# Altium schematic sheet E-12 USB PD.SchDoc: FRDM-IMX93
size 513 x 386 mm; DrawnBy: FORLINX; Organization: ORGANIZATION; Address1: ADDRESS 1; Address2: ADDRESS 2; Address3: ADDRESS 3; Address4: ADDRESS 4; Revision: -; ENG_APP_DATE: --/--/--; DSN_APP_DATE: --/--/--; CHK_APP_DATE: --/--/--; Classification: Public, Company Internal/Proprietary, Company Confidential,  Company Secret; Page Create Date: March  8, 1995; OrgName: NXP Semiconductor; FIUO: A; OrgAddr1: NO. 192 Liangjing Rd. Pudong New Area, ShangHai; Page Number: 12; PageTitle: USB PD; Page Size: C; Page Count: 23; Designer: FORLINX; RevCode: B1; Approver: NXP SE; Doc: SCH-94611 PDF: SPF-94611; DsnPath: T:\FILES\Designs\Single Board Computers\i.MX93-FRDM\Design Files\SCH-94611_B1.DSN; SchematicName: FRDM-i.MX 93 Development Board; PageName: E-12 USB PD; PageSize: C; TopSchematic: True
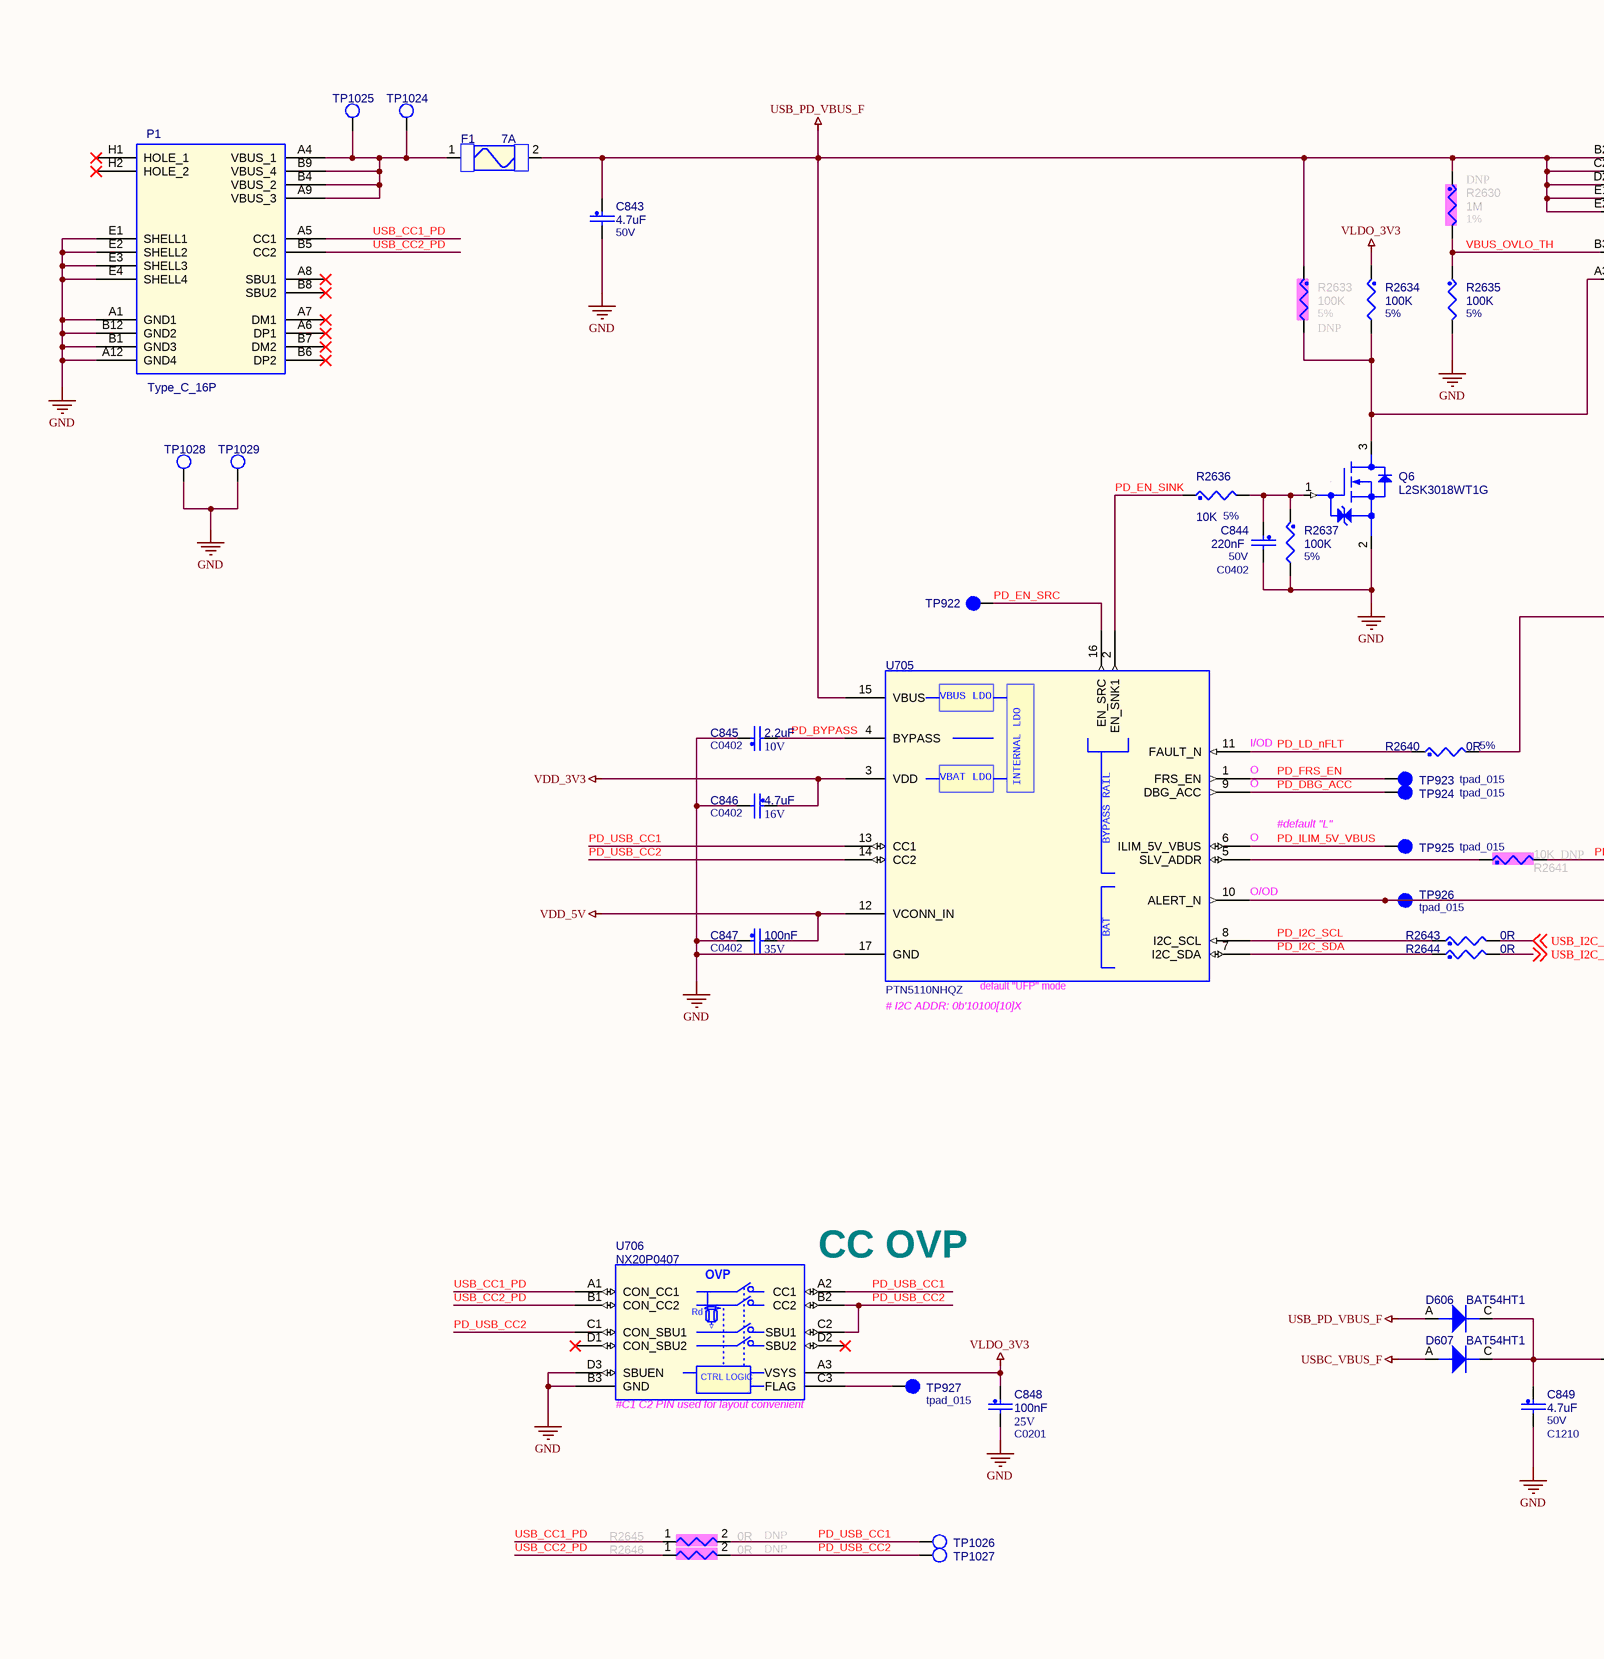
[diagram p0: E-12 USB PD.SchDoc, left]
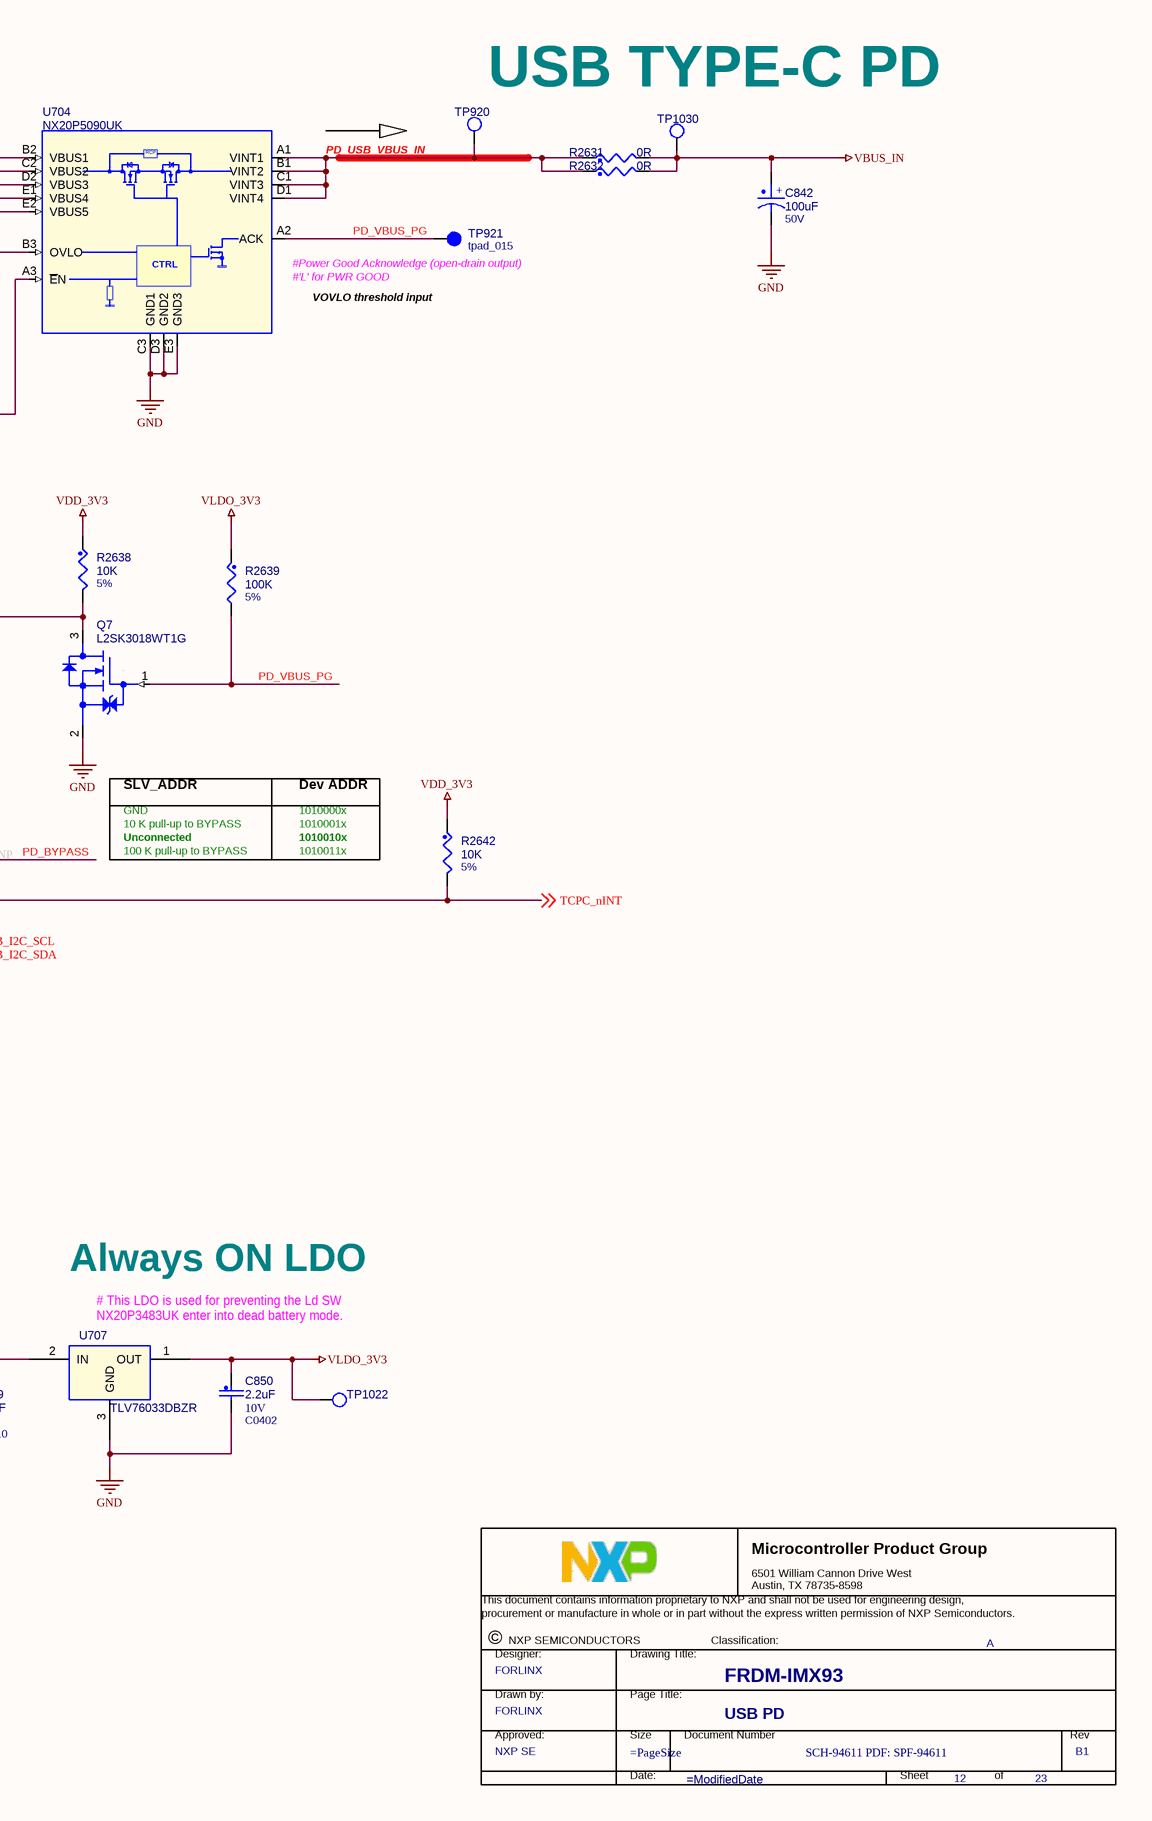
[diagram p1: E-12 USB PD.SchDoc, right]

## Parts
*  Title: FRDM-IMX93  RevCode: B1  PageTitle: USB PD  Page Number: 12  Page Count: 23  DrawnBy: FORLINX  Doc: SCH-94611 PDF: SPF-94611  Approver: NXP SE  FIUO: A  (graphical)
C842  100uF  VOLTAGE: 50V  [cce6P3x7p7]
C843  4.7uF  VOLTAGE: 50V  [C1210]
C844  220nF  VOLTAGE: 50V  [C0402]
C845  2.2uF  VOLTAGE: 10V  [C0402]
C846  4.7uF  VOLTAGE: 16V  [C0402]
C847  100nF  VOLTAGE: 35V  [C0402]
C848  100nF  VOLTAGE: 25V  [C0201]
C849  4.7uF  VOLTAGE: 50V  [C1210]
C850  2.2uF  VOLTAGE: 10V  [C0402]
D606  BAT54HT1  [SOD323]
D607  BAT54HT1  [SOD323]
F1  7A  [fuse_3p4x1p8]
P1  Type_C_16P  [TypeC_16P_S]
Q6  L2SK3018WT1G  [sc70_3]
Q7  L2SK3018WT1G  [sc70_3]
R2630  1M  ASSY_OPT: DNP  Tolerance: 1%  [R0201]
R2631  0R  [R0805]
R2632  0R  [R0805]
R2633  100K  ASSY_OPT: DNP  Tolerance: 5%  [R0201]
R2634  100K  Tolerance: 5%  [R0201]
R2635  100K  Tolerance: 5%  [R0201]
R2636  10K  Tolerance: 5%  [R0201]
R2637  100K  Tolerance: 5%  [R0201]
R2638  10K  Tolerance: 5%  [R0201]
R2639  100K  Tolerance: 5%  [R0201]
R2640  0R  Tolerance: 5%  [R0201]
R2641  10K  ASSY_OPT: DNP  [R0402]
R2642  10K  Tolerance: 5%  [R0201]
R2643  0R  [R0201]
R2644  0R  [R0201]
R2645  0R  ASSY_OPT: DNP  [R0201]
R2646  0R  ASSY_OPT: DNP  [R0201]
TP920  TPAD_020  [tpad_020]  (value not drawn)
TP921  TPAD_015  [tpad_015]
TP922  TPAD_015  [tpad_015]  (value not drawn)
TP923  TPAD_015  [tpad_015]
TP924  TPAD_015  [tpad_015]
TP925  TPAD_015  [tpad_015]
TP926  TPAD_015  [tpad_015]
TP927  TPAD_015  [tpad_015]
TP1022  TPAD_020  [tpad_020]  (value not drawn)
TP1024  TPAD_020  [tpad_020]  (value not drawn)
TP1025  TPAD_020  [tpad_020]  (value not drawn)
TP1026  TPAD_020  [tpad_020]  (value not drawn)
TP1027  TPAD_020  [tpad_020]  (value not drawn)
TP1028  TPAD_020  [tpad_020]  (value not drawn)
TP1029  TPAD_020  [tpad_020]  (value not drawn)
TP1030  TPAD_020  [tpad_020]  (value not drawn)
U704  NX20P5090UK  [wlcsp15_0p5_1p57x2p59]
U705  MFG_PN01: PTN5110NHQZ  [hx2qfn16_0p4_2p7x2p7]  (hidden comment: PTN5110)
U706  NX20P0407  [wlcsp12_0p4_1p3x1p7mm_smdp]
U707  TLV76033DBZR  [sot23_a]

## Nets
GND: C842.2 C843.2 C844.2 C845.1 C846.2 C847.1 C848.2 C849.2 C850.2 P1.A1(GND1) P1.A12(GND4) P1.B1(GND3) P1.B12(GND2) P1.E1(SHELL1) P1.E2(SHELL2) P1.E3(SHELL3) P1.E4(SHELL4) Q6.2(SOURCE) Q7.2(SOURCE) R2635.2 R2637.2 TP1028.1(TP) TP1029.1(TP) U704.C3(GND1) U704.D3(GND2) U704.E3(GND3) U705.17(GND) U706.B3(GND) U706.D3(SBUEN) U707.3(GND)
USB_PD_VBUS_F: C843.1 D606.A(ANODE) F1.2 R2630.1 R2633.1 U704.B2(VBUS1) U704.C2(VBUS2) U704.D2(VBUS3) U704.E1(VBUS4) U704.E2(VBUS5) U705.15(VBUS)
USBC_VBUS_F: D607.A(ANODE)
VBUS_IN: C842.1 R2631.2 R2632.2 TP1030.1(TP)
VDD_3V3: C846.1 R2638.1 R2642.1 U705.3(VDD)
VDD_5V: C847.2 U705.12(VCONN_IN)
VLDO_3V3: C848.1 C850.1 R2634.1 R2639.1 TP1022.1(TP) U706.A3(VSYS) U707.1(OUT)
PD_BYPASS: C845.2 R2641.2 U705.4(BYPASS)
PD_DBG_ACC: TP924.1(Pin1) U705.9(DBG_ACC)
PD_EN_SINK: R2636.1 U705.2(EN_SNK1)
PD_EN_SRC: TP922.1(Pin1) U705.16(EN_SRC)
PD_FRS_EN: TP923.1(Pin1) U705.1(FRS_EN)
PD_I2C_SCL: R2643.1 U705.8(I2C_SCL)
PD_I2C_SDA: R2644.1 U705.7(I2C_SDA)
PD_ILIM_5V_VBUS: TP925.1(Pin1) U705.6(ILIM_5V_VBUS)
PD_LD_nFLT: R2640.1 U705.11(FAULT_N)
PD_USB_CC1: R2645.2 TP1026.1(TP) U705.13(CC1) U706.A2(CC1)
PD_USB_CC2: R2646.2 TP1027.1(TP) U705.14(CC2) U706.B2(CC2) U706.C1(CON_SBU1) U706.C2(SBU1)
PD_USB_VBUS_IN: R2631.1 R2632.1 TP920.1(TP) U704.A1(VINT1) U704.B1(VINT2) U704.C1(VINT3) U704.D1(VINT4)
PD_VBUS_PG: Q7.1(GATE) R2639.2 TP921.1(Pin1) U704.A2(ACK)
TCPC_nINT: R2642.2 TP926.1(Pin1) U705.10(ALERT_N) ; off-sheet TCPC_nINT
USB_CC1_PD: P1.A5(CC1) R2645.1 U706.A1(CON_CC1)
USB_CC2_PD: P1.B5(CC2) R2646.1 U706.B1(CON_CC2)
USB_I2C_SCL: R2643.2 ; off-sheet USB_I2C_SCL
USB_I2C_SDA: R2644.2 ; off-sheet USB_I2C_SDA
VBUS_OVLO_TH: R2630.2 R2635.1 U704.B3(OVLO)
NetC844_1: C844.1 Q6.1(GATE) R2636.2 R2637.1
NetC849_1: C849.1 D606.C(CATHODE) D607.C(CATHODE) U707.2(IN)
NetF1_1: F1.1 P1.A4(VBUS_1) P1.A9(VBUS_3) P1.B4(VBUS_2) P1.B9(VBUS_4) TP1024.1(TP) TP1025.1(TP)
NetQ6_3: Q6.3(DRAIN) R2633.2 R2634.2 U704.A3(~{E}N)
NetQ7_3: Q7.3(DRAIN) R2638.2 R2640.2
NetR2641_1: R2641.1 U705.5(SLV_ADDR)
NetTP927_1: TP927.1(Pin1) U706.C3(FLAG)

Not connected (* = marked no-connect by the designer): P1 A6(DP1)* A7(DM1)* A8(SBU1)* B6(DP2)* B7(DM2)* B8(SBU2)* H1(HOLE_1)* H2(HOLE_2)*; U706 D1(CON_SBU2)* D2(SBU2)*

## Notes on the sheet
- USB TYPE-C PD
- #Power Good Acknowledge (open-drain output)
- (near U704) #'L' for PWR GOOD
- VOVLO threshold input
- (near U705) I/OD
- (near U705) O
- SLV_ADDR
- GND
- 1010000x
- Dev ADDR
- #default "L"
- Unconnected
- 100 K pull-up to BYPASS
- 10 K pull-up to BYPASS
- 1010001x
- 1010010x
- 1010011x
- (near U705) O/OD
- (near U705) # I2C ADDR: 0b'10100[10]X
- (near U705) default "UFP" mode
- (near U706) CC OVP
- Always ON LDO
- (near U707) # This LDO is used for preventing the Ld SW
  NX20P3483UK enter into dead battery mode.
- (near U706) #C1 C2 PIN used for layout convenient
- DWG. NO.
- REV.
- SHT.
- REVISION
- DESCRIPTION
- DATE
- APPROVED
- ENG:
- APPROVALS
- quilter.ai <http://quilter.ai>
- DSN:
- CHK:
- REFERENCE DOCUMENTS
- TITLE
- PROJECT
- BOM:
- FAB DWG:
- PCB DWG:
- ASSY DWG:
- SIZE
- FILE NAME
- C
- DWG NO.
- SHEET
- OF
- REV
- (in symbol CAP_POL) +
- (in symbol NX20P0407_WLCSP12_A) OVP; Rd; CTRL LOGIC
- (in symbol NX20P5090UK_15P_A) RCP; CTRL
- (in symbol PTN5110_QFN16) VBUS LDO; VBAT LDO; INTERNAL LDO; BYPASS RAIL; BAT
- (in symbol TitleBlock_MCPG) Microcontroller Product Group; 6501 William Cannon Drive West / Austin, TX 78735-8598; This document contains information proprietary to NXP and shall not be used for engineering design,; procurement or manufacture in whole or in part without the express written permission of NXP Semiconductors.; ©; NXP SEMICONDUCTORS; Classification:; Designer:; Drawing Title:; Drawn by:; Page Title:; Approved:; Size; Document Number; Rev; Date:; Sheet; of

## Library data of the parts
* = TitleBlock_MCPG: Classification: Public, Company Internal/Proprietary, Company Confidential,  Company Secret; OrgAddr1: NO. 192 Liangjing Rd. Pudong New Area, ShangHai; OrgName: NXP Semiconductor; Page Size: =PageSize; Page Create Date: March  8, 1995; Designer: FORLINX; Page Modify Date: =ModifiedDate
C842 = CAP_POL: 100uF,35V,6.3*7.7mm; Part Reference: C842; CLASS: DISCRETE; CAD_APPROVED: Yes; MFG_PN01: CS1V101M-CRE77; MFG_NAME01: ST(Xianke); Tolerance: 20%; Value: 100uF; HEIGHT: 10.5MM; ROHS: Yes; PCB Footprint: cce6P3x7p7
C843 = CAP_NP: 1210,4.7uF,50V,+/-10%,X7R; Part Reference: C843; CLASS: DISCRETE; FPLIST: CC1210,1210_CC; CAD_APPROVED: Yes; MFG_PN01: GRM32ER71H475KA88L; MFG_NAME01: MURATA; Tolerance: 10%; Value: 4.7uF; HEIGHT: 2.7MM; ROHS: Yes; PCB Footprint: C1210
C844 = CAP_NP: 0402,220nF,25V,+/-10%,X5R; Part Reference: C844; CLASS: DISCRETE; FPLIST: CC0402_25,CC0402_HD,0402_CC; CAD_APPROVED: Yes; Temp_Range: -55¡ãC to +85¡ãC; MFG_PN01: CL05A224KA5NNNC; MFG_NAME01: SAMSUNG; Tolerance: 10%; Value: 220nF; HEIGHT: 0.55MM; ROHS: Yes; Package Size: 0402; Temp Range: -55¡ãC to +85¡ãC; PCB Footprint: C0402
C845 = CAP_NP: 0402,2.2uF,10V,+/-10%,X5R; Part Reference: C845; CLASS: DISCRETE; FPLIST: CC0402_25,CC0402_HD,0402_CC,capc0402_l; CAD_APPROVED: Yes; MFG_PN01: CL05A225KP5NSNC; MFG_NAME01: SAMSUNG; Tolerance: 10%; Value: 2.2uF; HEIGHT: 0.55 MM; ROHS: Yes; Package Size: 0402; PCB Footprint: C0402
C846 = CAP_NP: 0402,4.7uF,10V,+/-10%,X5R; Part Reference: C846; CLASS: DISCRETE; Temp Range: -55¡ãC to + 85¡ãC; FPLIST: CC0603_OV,CC0603,cc0603_0805_nsp,0603_CC_NSP; CAD_APPROVED: Yes; MFG_PN01: CL05A475KP5NRNC; MFG_NAME01: SAMSUNG; Value: 4.7uF; HEIGHT: 0.95MM; ROHS: Yes; PCB Footprint: C0402
C847 = CAP_NP: 0402,100nF,50V,+/-10%,X5R; Part Reference: C847; CLASS: DISCRETE; FPLIST: CC0402_25,CC0402_HD,0402_CC,capc0402_l; CAD_APPROVED: Yes; MFG_PN01: 0402X104K500NT; MFG_NAME01: FENGHUA; Tolerance: 10%; Value: 100nF; HEIGHT: 0.55MM; ROHS: Yes; PCB Footprint: C0402
C848 = CAP_NP: 0201,100nF,25V,+/-10%,X5R; Part Reference: C848; CLASS: DISCRETE; Tolerance: 10%; MFG_NAME01: FENGHUA; MFG_PN01: 0201X104K250NT; CAD_APPROVED: Yes; FPLIST: CC0402_25,CC0402_HD,0402_CC,capc0402_l; Value: 100nF; ROHS: Yes; HEIGHT: 0.55MM; PCB Footprint: C0201
C849 = CAP_NP: 1210,4.7uF,50V,+/-10%,X7R; Part Reference: C849; CLASS: DISCRETE; FPLIST: CC1210,1210_CC; CAD_APPROVED: Yes; MFG_PN01: GRM32ER71H475KA88L; MFG_NAME01: MURATA; Tolerance: 10%; Value: 4.7uF; HEIGHT: 2.7MM; ROHS: Yes; PCB Footprint: C1210
C850 = CAP_NP: 0402,2.2uF,10V,+/-10%,X5R; Part Reference: C850; CLASS: DISCRETE; Tolerance: 10%; MFG_NAME01: SAMSUNG; MFG_PN01: CL05A225KP5NSNC; CAD_APPROVED: Yes; FPLIST: CC0402_25,CC0402_HD,0402_CC,capc0402_l; Value: 2.2uF; Package Size: 0402; ROHS: Yes; HEIGHT: 0.55 MM; PCB Footprint: C0402
D606 = DIODE: BAT54HT1G,SOD323; Part Reference: D606; CLASS: IC; MFG_NAME01: JSCJ; CAD_APPROVED: Yes; Value: BAT54HT1; MFG_PN01: BAT54HT1G; HEIGHT: 1.15MM; PCB Footprint: SOD323
D607 = DIODE: BAT54HT1G,SOD323; Part Reference: D607; CLASS: IC; CAD_APPROVED: Yes; MFG_NAME01: JSCJ; Value: BAT54HT1; HEIGHT: 1.15MM; MFG_PN01: BAT54HT1G; PCB Footprint: SOD323
F1 = FUSE: Fuse,1206,7A,32V; Part Reference: F1; CLASS: DISCRETE; MFG_NAME01: JDT fuse; MFG_PN01: JFC1206-1700FS; CAD_APPROVED: Yes; Value: 7A; ROHS: Yes; HEIGHT: 0.8639MM; PCB Footprint: fuse_3p4x1p8
P1 = Type_C_16P: USB616FC-C2014216,USB2.0,type-c; Part Reference: P1; MFG_NAME01: ATOM; Value: Type_C_16P; MFG_PN01: USB616FC-C2014216; PCB Footprint: TypeC_16P_S
Q6 = NX3008NBKW_SOT323: Part Reference: Q6; CLASS: IC; CAD_APPROVED: Yes; MFG_NAME01: LRC; Value: L2SK3018WT1G; HEIGHT: 1.1MM; ROHS: Yes; MFG_PN01: L2SK3018WT1G; PCB Footprint: sc70_3
Q7 = NX3008NBKW_SOT323: Part Reference: Q7; CLASS: IC; MFG_NAME01: LRC; CAD_APPROVED: Yes; Value: L2SK3018WT1G; MFG_PN01: L2SK3018WT1G; ROHS: Yes; HEIGHT: 1.1MM; PCB Footprint: sc70_3
R2630 = RES: 0201,1M,+/-1%; Part Reference: R2630; CLASS: DISCRETE; MFG_NAME01: FENGHUA; MFG_PN01: RC-01W1004FT; CAD_APPROVED: Yes; FPLIST: RC0402_25,RC0402_HD,0402_CC; Value: 1M; ROHS: Yes; HEIGHT: 0.4MM; PCB Footprint: R0201
R2631 = RES: 0805,0Ohm+/-5%; Part Reference: R2631; CLASS: DISCRETE; MFG_PN01: RS-05000JT; MFG_NAME01: FENGHUA; Temp Range: -55 ¡ãC to +155 ¡ãC; VOLTAGE: 150V; CAD_APPROVED: Yes; FPLIST: RC0805_OV,RC0805,0805_CC; Value: 0R; ROHS: Yes; HEIGHT: 0.6MM; PCB Footprint: R0805
R2632 = RES: 0805,0Ohm+/-5%; Part Reference: R2632; CLASS: DISCRETE; FPLIST: RC0805_OV,RC0805,0805_CC; CAD_APPROVED: Yes; VOLTAGE: 150V; Temp Range: -55 ¡ãC to +155 ¡ãC; MFG_NAME01: FENGHUA; MFG_PN01: RS-05000JT; Value: 0R; HEIGHT: 0.6MM; ROHS: Yes; PCB Footprint: R0805
R2633 = RES: 0201,100K,+/-1%; Part Reference: R2633; CLASS: DISCRETE; Temp Range: -55C to +155C; VOLTAGE: 50V; MFG_NAME01: FENGHUA; MFG_PN01: RC-01W1003FT; CAD_APPROVED: Yes; FPLIST: RC0402_25,RC0402_HD,0402_CC; Value: 100K; Temp_Range: -55C to +155C; HEIGHT: 0.40 MM; ROHS: Yes; PCB Footprint: R0201
R2634 = RES: 0201,100K,+/-1%; Part Reference: R2634; CLASS: DISCRETE; Temp Range: -55C to +155C; VOLTAGE: 50V; MFG_NAME01: FENGHUA; MFG_PN01: RC-01W1003FT; CAD_APPROVED: Yes; FPLIST: RC0402_25,RC0402_HD,0402_CC; Value: 100K; Temp_Range: -55C to +155C; HEIGHT: 0.40 MM; ROHS: Yes; PCB Footprint: R0201
R2635 = RES: 0201,100K,+/-1%; Part Reference: R2635; CLASS: DISCRETE; Temp Range: -55C to +155C; VOLTAGE: 50V; MFG_NAME01: FENGHUA; MFG_PN01: RC-01W1003FT; CAD_APPROVED: Yes; FPLIST: RC0402_25,RC0402_HD,0402_CC; Value: 100K; Temp_Range: -55C to +155C; HEIGHT: 0.40 MM; ROHS: Yes; PCB Footprint: R0201
R2636 = RES: 0201,10K,+/-5%; Part Reference: R2636; CLASS: DISCRETE; MFG_NAME01: FENGHUA; MFG_PN01: RC-01W103JT; CAD_APPROVED: Yes; FPLIST: RC0402_25,RC0402_HD,0402_CC; Value: 10K; ROHS: Yes; HEIGHT: 0.4 MM; PCB Footprint: R0201
R2637 = RES: 0201,100K,+/-1%; Part Reference: R2637; CLASS: DISCRETE; FPLIST: RC0402_25,RC0402_HD,0402_CC; CAD_APPROVED: Yes; MFG_PN01: RC-01W1003FT; MFG_NAME01: FENGHUA; Temp_Range: -55C to +155C; VOLTAGE: 50V; Value: 100K; ROHS: Yes; HEIGHT: 0.40 MM; Temp Range: -55C to +155C; PCB Footprint: R0201
R2638 = RES: 0201,10K,+/-5%; Part Reference: R2638; CLASS: DISCRETE; MFG_NAME01: FENGHUA; MFG_PN01: RC-01W103JT; CAD_APPROVED: Yes; FPLIST: RC0402_25,RC0402_HD,0402_CC; Value: 10K; ROHS: Yes; HEIGHT: 0.4 MM; PCB Footprint: R0201
R2639 = RES: 0201,100K,+/-1%; Part Reference: R2639; CLASS: DISCRETE; FPLIST: RC0402_25,RC0402_HD,0402_CC; CAD_APPROVED: Yes; MFG_PN01: RC-01W1003FT; MFG_NAME01: FENGHUA; Temp_Range: -55C to +155C; VOLTAGE: 50V; Value: 100K; ROHS: Yes; HEIGHT: 0.40 MM; Temp Range: -55C to +155C; PCB Footprint: R0201
R2640 = RES: 0201,0Ohm,+/-5%; Part Reference: R2640; CLASS: DISCRETE; VOLTAGE: 1/16W; FPLIST: RC0402_25,RC0402_HD,RC0402_X2,0402_CC; CAD_APPROVED: Yes; MFG_PN01: RC-01000JT; MFG_NAME01: FENGHUA; Value: 0R; HEIGHT: 0.45 MM; ROHS: Yes; PCB Footprint: R0201
R2641 = RES: 0402,10K,+/-1%; Part Reference: R2641; CLASS: DISCRETE; FPLIST: RC0402_25,RC0402_HD,0402_CC; CAD_APPROVED: Yes; MFG_PN01: RC-02W1002FT; MFG_NAME01: FENGHUA; Tolerance: 5%; Value: 10K; HEIGHT: 0.4 MM; ROHS: Yes; PCB Footprint: R0402
R2642 = RES: 0201,10K,+/-5%; Part Reference: R2642; CLASS: DISCRETE; FPLIST: RC0402_25,RC0402_HD,0402_CC; CAD_APPROVED: Yes; MFG_PN01: RC-01W103JT; MFG_NAME01: FENGHUA; Value: 10K; HEIGHT: 0.4 MM; ROHS: Yes; PCB Footprint: R0201
R2643 = RES: 0201,0Ohm,+/-5%; Part Reference: R2643; CLASS: DISCRETE; FPLIST: RC0402_25,RC0402_HD,RC0402_X2,0402_CC; CAD_APPROVED: Yes; MFG_PN01: RC-01000JT; MFG_NAME01: FENGHUA; Tolerance: 5%; VOLTAGE: 1/16W; Value: 0R; ROHS: Yes; HEIGHT: 0.45 MM; PCB Footprint: R0201
R2644 = RES: 0201,0Ohm,+/-5%; Part Reference: R2644; CLASS: DISCRETE; FPLIST: RC0402_25,RC0402_HD,RC0402_X2,0402_CC; CAD_APPROVED: Yes; MFG_PN01: RC-01000JT; MFG_NAME01: FENGHUA; Tolerance: 5%; VOLTAGE: 1/16W; Value: 0R; ROHS: Yes; HEIGHT: 0.45 MM; PCB Footprint: R0201
R2645 = RESISTOR: 0201,0Ohm,+/-5%; Part Reference: R2645; Manufacturer PN: RC0402FR-0743KL; Manufacturer: YAGEO; Tolerance: 1%; MFG_PN01: RC-01000JT; Wattage: 1/16W; Priority: A; MFG_NAME01: FENGHUA; PCB Footprint: R0201; Value: 0R; Created by: YTL; Part Type: Í¨ÓÃºñÄ¤µç×è; RK PN: RC0402FR-0743KL
R2646 = RESISTOR: 0201,0Ohm,+/-5%; Part Reference: R2646; Manufacturer: YAGEO; Tolerance: 1%; MFG_NAME01: FENGHUA; RK PN: RC0402FR-0743KL; Priority: A; Wattage: 1/16W; MFG_PN01: RC-01000JT; PCB Footprint: R0201; Value: 0R; Part Type: Í¨ÓÃºñÄ¤µç×è; Manufacturer PN: RC0402FR-0743KL; Created by: YTL
TP920 = T POINT R: no part to order; Part Reference: TP920; ASSY_OPT: DNP; CLASS: IC; CAD_APPROVED: Yes; MFG_PN01: NOT A COMPONENT; HEIGHT: 0.1MM; ROHS: Yes; MFG_NAME01: NOT A COMPONENT; PCB Footprint: tpad_020
TP921 = TESTLOOP: no part to order; Part Reference: TP921; CLASS: IO; ASSY_OPT: DNP; CAD_APPROVED: Yes; MFG_PN01: NOT A COMPONENT; HEIGHT: 0.1MM; ROHS: Yes; MFG_NAME01: NOT A COMPONENT; PCB Footprint: tpad_015
TP922 = TESTLOOP: no part to order; Part Reference: TP922; CLASS: IO; ASSY_OPT: DNP; MFG_NAME01: NOT A COMPONENT; CAD_APPROVED: Yes; MFG_PN01: NOT A COMPONENT; ROHS: Yes; HEIGHT: 0.1MM; PCB Footprint: tpad_015
TP923 = TESTLOOP: no part to order; Part Reference: TP923; CLASS: IO; ASSY_OPT: DNP; CAD_APPROVED: Yes; MFG_PN01: NOT A COMPONENT; HEIGHT: 0.1MM; ROHS: Yes; MFG_NAME01: NOT A COMPONENT; PCB Footprint: tpad_015
TP924 = TESTLOOP: no part to order; Part Reference: TP924; CLASS: IO; ASSY_OPT: DNP; CAD_APPROVED: Yes; MFG_PN01: NOT A COMPONENT; HEIGHT: 0.1MM; ROHS: Yes; MFG_NAME01: NOT A COMPONENT; PCB Footprint: tpad_015
TP925 = TESTLOOP: no part to order; Part Reference: TP925; CLASS: IO; ASSY_OPT: DNP; MFG_NAME01: NOT A COMPONENT; CAD_APPROVED: Yes; MFG_PN01: NOT A COMPONENT; ROHS: Yes; HEIGHT: 0.1MM; PCB Footprint: tpad_015
TP926 = TESTLOOP: no part to order; Part Reference: TP926; CLASS: IO; ASSY_OPT: DNP; MFG_NAME01: NOT A COMPONENT; CAD_APPROVED: Yes; MFG_PN01: NOT A COMPONENT; ROHS: Yes; HEIGHT: 0.1MM; PCB Footprint: tpad_015
TP927 = TESTLOOP: no part to order; Part Reference: TP927; CLASS: IO; ASSY_OPT: DNP; CAD_APPROVED: Yes; MFG_PN01: NOT A COMPONENT; HEIGHT: 0.1MM; ROHS: Yes; MFG_NAME01: NOT A COMPONENT; PCB Footprint: tpad_015
TP1022 = T POINT R: no part to order; Part Reference: TP1022; ASSY_OPT: DNP; CLASS: IC; MFG_NAME01: NOT A COMPONENT; CAD_APPROVED: Yes; MFG_PN01: NOT A COMPONENT; ROHS: Yes; HEIGHT: 0.1MM; PCB Footprint: tpad_020
TP1024 = T POINT R: no part to order; Part Reference: TP1024; ASSY_OPT: DNP; CLASS: IC; MFG_NAME01: NOT A COMPONENT; CAD_APPROVED: Yes; MFG_PN01: NOT A COMPONENT; ROHS: Yes; HEIGHT: 0.1MM; PCB Footprint: tpad_020
TP1025 = T POINT R: no part to order; Part Reference: TP1025; ASSY_OPT: DNP; CLASS: IC; MFG_NAME01: NOT A COMPONENT; CAD_APPROVED: Yes; MFG_PN01: NOT A COMPONENT; ROHS: Yes; HEIGHT: 0.1MM; PCB Footprint: tpad_020
TP1026 = T POINT R: no part to order; Part Reference: TP1026; ASSY_OPT: DNP; CLASS: IC; MFG_NAME01: NOT A COMPONENT; CAD_APPROVED: Yes; MFG_PN01: NOT A COMPONENT; ROHS: Yes; HEIGHT: 0.1MM; PCB Footprint: tpad_020
TP1027 = T POINT R: no part to order; Part Reference: TP1027; ASSY_OPT: DNP; CLASS: IC; MFG_NAME01: NOT A COMPONENT; CAD_APPROVED: Yes; MFG_PN01: NOT A COMPONENT; ROHS: Yes; HEIGHT: 0.1MM; PCB Footprint: tpad_020
TP1028 = T POINT R: no part to order; Part Reference: TP1028; ASSY_OPT: DNP; CLASS: IC; MFG_NAME01: NOT A COMPONENT; CAD_APPROVED: Yes; MFG_PN01: NOT A COMPONENT; ROHS: Yes; HEIGHT: 0.1MM; PCB Footprint: tpad_020
TP1029 = T POINT R: no part to order; Part Reference: TP1029; ASSY_OPT: DNP; CLASS: IC; MFG_NAME01: NOT A COMPONENT; CAD_APPROVED: Yes; MFG_PN01: NOT A COMPONENT; ROHS: Yes; HEIGHT: 0.1MM; PCB Footprint: tpad_020
TP1030 = T POINT R: no part to order; Part Reference: TP1030; ASSY_OPT: DNP; CLASS: IC; CAD_APPROVED: Yes; MFG_PN01: NOT A COMPONENT; HEIGHT: 0.1MM; ROHS: Yes; MFG_NAME01: NOT A COMPONENT; PCB Footprint: tpad_020
U704 = NX20P5090UK_15P_A: IC USB PWR SW 5A 2.5-20V WLCSP15; Manufacturer: NXP Semiconductors; Part Reference: U704; MFG_PN01: NX20P5090UKAZ; Manufacturer Part Number: NX20P5090UK; CLASS: IC; Value: NX20P5090UK; MFG_NAME01: NXP SEMICONDUCTORS; PCB Footprint: wlcsp15_0p5_1p57x2p59
U705 = PTN5110_QFN16: IC USB PD PHY 1PORT 2.7-5.5V HX2QFN16; Part Reference: U705; Temp Range: ¨C40C to +85C; CAD_APPROVED: Yes; MFG_NAME01: NXP SEMICONDUCTORS; CLASS: IC; Value: PTN5110; VOLTAGE: 2.7-5.5V; HEIGHT: 0.4MM; Temp_Range: ¨C40C to +85C; ROHS: Yes; PCB Footprint: hx2qfn16_0p4_2p7x2p7
U706 = NX20P0407_WLCSP12_A: IC USB TYPE C PROTECTION +15KV/+8KV ESD WLCSP12; Manufacturer: NXP Semiconductors; Manufacturer Part Number: NX20P5090UK; Part Reference: U706; Temp Range: -40C to +85C; PRE_APN: 312-81846; CAD_APPROVED: Yes; CLASS: IC; Value: NX20P0407; MFG_PN01: NX20P0407; MFG_NAME01: NXP SEMICONDUCTORS; VOLTAGE: +15KV/+8KV; ROHS: Yes; HEIGHT: 0.565 MM; PCB Footprint: wlcsp12_0p4_1p3x1p7mm_smdp
U707 = SGM2034-3_0.3YN3G: TLV76033DBZR,SOT23-3,Fixed output linear voltage regulator, up to 30V input, 100mA output, 3.3V output; Part Reference: U707; MFG_NAME01: Nexperia; Value: TLV76033DBZR; MFG_PN01: TLV76033DBZR; PCB Footprint: sot23_a